# Altium project PELT_DRIVE.PrjPcb
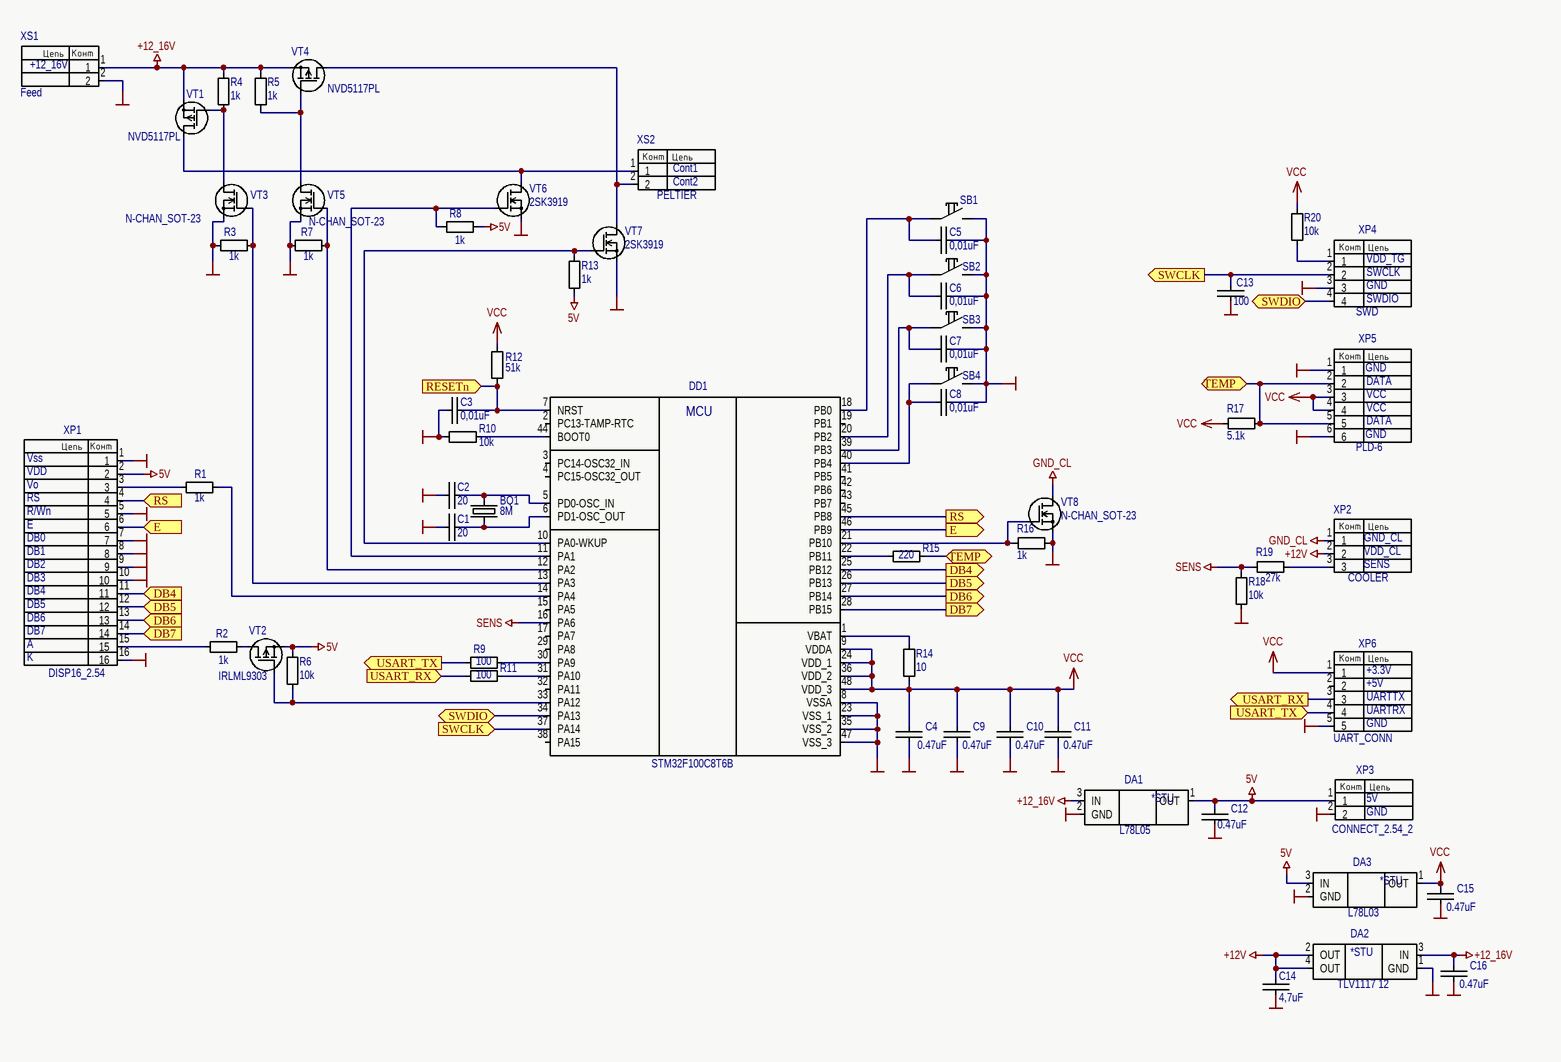
[diagram p0: PELT_DRIVE.SchDoc]
1 sheet, 61 parts. Net scope: flat (ports and power ports of the same name join across sheets).
Board file: PELT_DRIVE.PcbDoc

## Sheet PELT_DRIVE.SchDoc
size 420 x 297 mm; Scale: {Масш.}; Title1str: {Наименование}; PageSetup: Record=PageOptions|CenterHorizontal=False|CenterVertical=False|PrintScale=0.67|XCorrection=0.00|YCorrection=0.00|PrintKind=1|BorderSize=5000000|LeftOffset=0|BottomOffset=0|Orientation=2|PaperLength=1000|PaperWidth=1000|Scale=100|PaperSource=7|PrintQuality=600|MediaType=1|DitherType=10|PaperKind=A4|PrintScaleMode=1; Title2str: {Наименование}; ProcessInspection: {Т.контр.}; Mass: {Масса}; NormInspection: {Н.контр.}; EngineerName: {Инженер}; Letter1Column: {}; Letter2Column: {}; Letter3Column: {}; DocumentType: ?????????????? ?????; DocumentType1str: {Документ}; DocumentType2str: {Документ}

### Parts
BQ1  8M  [HC 49S]
C1  20  [Cap_0805]
C2  20  [Cap_0805]
C3  0,01uF  [Cap_0805]
C4  0.47uF  [Cap_0805]
C5  0,01uF  [Cap_0805]
C6  0,01uF  [Cap_0805]
C7  0,01uF  [Cap_0805]
C8  0,01uF  [Cap_0805]
C9  0.47uF  [Cap_0805]
C10  0.47uF  [Cap_0805]
C11  0.47uF  [Cap_0805]
C12  0.47uF  [Cap_0805]
C13  100  [Cap_0805]
C14  4,7uF  [Cap_0805]
C15  0.47uF  [Cap_0805]
C16  0.47uF  [Cap_0805]
DA1  L78L05  [kren]
DA2  TLV1117 12  [SOT223]
DA3  L78L03  [kren]
DD1  STM32F100C8T6B  [LQFP48]
R1  1k  [Res_0805]
R2  1k  [Res_0805]
R3  1k  [Res_0805]
R4  1k  [Res_0805]
R5  1k  [Res_0805]
R6  10k  [Res_0805]
R7  1k  [Res_0805]
R8  1k  [Res_0805]
R9  100  [Res_0805]
R10  10k  [Res_0805]
R11  100  [Res_0805]
R12  51k  [Res_0805]
R13  1k  [Res_0805]
R14  10  [Res_0805]
R15  220  [Res_0805]
R16  1k  [Res_0805]
R17  5.1k  [Res_0805]
R18  10k  [Res_0805]
R19  27k  [Res_0805]
R20  10k  [Res_0805]
SB1  BUTTON 4.5x6  [BUTTON 6x4.5]  (value not drawn)
SB2  BUTTON 4.5x6  [BUTTON 6x4.5]  (value not drawn)
SB3  BUTTON 4.5x6  [BUTTON 6x4.5]  (value not drawn)
SB4  BUTTON 4.5x6  [BUTTON 6x4.5]  (value not drawn)
VT1  NVD5117PL  [TO-252]
VT2  IRLML9303  [SOT-23]
VT3  N-CHAN_SOT-23  [SOT-23]
VT4  NVD5117PL  [TO-252]
VT5  N-CHAN_SOT-23  [SOT-23]
VT6  2SK3919  [TO-252]
VT7  2SK3919  [TO-252]
VT8  N-CHAN_SOT-23  [SOT-23]
XP1  DISP16_2.54  [DISP16_2.54]
XP2  COOLER  [CONN_2.54_3]
XP3  CONNECT_2.54_2  [CONN_2.54_2]
XP4  SWD  [CONN_2.54_4]
XP5  PLD-6  [CONN_2.54_6_2]
XP6  UART_CONN  [CONN_2.54_5]
XS1  Feed  [PELTIER]
XS2  PELTIER  [PELTIER]

### Ports
DB4 (in), DB4 (out), DB5 (in), DB5 (out), DB6 (in), DB6 (out), DB7 (in), DB7 (out), E (in), E (out), RESETn (in), RS (in), RS (out), SWCLK (in), SWCLK (out), SWDIO (bidir), TEMP (bidir), USART_RX (in), USART_RX (out), USART_TX (in), USART_TX (out)

### Nets
5V: C12.2 DA1.1(OUT) DA3.3(IN) R6.1 R8.2 R13.1 VT2.2 XP1.2 XP3.1
+12_16V: C16.2 DA1.3(IN) DA2.3(IN) R4.1 R5.2 VT1.3 VT4.3 XS1.1
+12V: C14.2 DA2.2(OUT) DA2.4(OUT) XP2.2
GND: C1.1 C2.1 C3.1 C4.1 C5.2 C6.2 C7.2 C8.2 C9.1 C10.1 C11.1 C12.1 C13.1 C14.1 C15.1 C16.1 DA1.2(GND) DA2.1(GND) DA3.2(GND) DD1.8(VSSA) DD1.23(VSS_1) DD1.35(VSS_2) DD1.47(VSS_3) R3.2 R7.1 R10.2 R16.2 R18.1 SB1.2(IN) SB2.2(IN) SB3.2(IN) SB4.2(IN) VT3.2 VT5.2 VT6.3 VT7.3 VT8.2 XP1.1 XP1.5 XP1.7 XP1.8 XP1.9 XP1.10 XP1.16 XP3.2 XP4.3 XP5.1 XP5.6 XP6.5 XS1.2
GND_CL: VT8.3 XP2.1
SENS: DD1.16(PA6) R18.2 R19.2
VCC: C4.2 C9.2 C10.2 C11.2 C15.2 DA3.1(OUT) DD1.9(VDDA) DD1.24(VDD_1) DD1.36(VDD_2) DD1.48(VDD_3) R12.2 R14.2 R17.2 R20.2 XP5.3 XP5.4 XP6.1
NetBQ1_1: BQ1.1 C1.2 DD1.6(PD1-OSC_OUT)
NetBQ1_2: BQ1.2 C2.2 DD1.5(PD0-OSC_IN)
NetC3_2: C3.2 DD1.7(NRST) R12.1 ; port RESETn
NetC5_1: C5.1 DD1.18(PB0) SB1.1(OUT)
NetC6_1: C6.1 DD1.20(PB2) SB2.1(OUT)
NetC7_1: C7.1 DD1.39(PB3) SB3.1(OUT)
NetC8_1: C8.1 DD1.40(PB4) SB4.1(OUT)
NetC13_2: C13.2 DD1.37(PA14) XP4.2 ; port SWCLK
NetDD1_1: DD1.1(VBAT) R14.1
NetDD1_10: DD1.10(PA0-WKUP) R13.2 VT7.1
NetDD1_11: DD1.11(PA1) R8.1 VT6.1
NetDD1_12: DD1.12(PA2) R7.2 VT5.1
NetDD1_13: DD1.13(PA3) R3.1 VT3.1
NetDD1_14: DD1.14(PA4) R1.1
NetDD1_21: DD1.21(PB10) R16.1 VT8.1
NetDD1_22: DD1.22(PB11) R15.2
NetDD1_25: DD1.25(PB12) XP1.11 ; port DB4
NetDD1_26: DD1.26(PB13) XP1.12 ; port DB5
NetDD1_27: DD1.27(PB14) XP1.13 ; port DB6
NetDD1_28: DD1.28(PB15) XP1.14 ; port DB7
NetDD1_30: DD1.30(PA9) R9.2
NetDD1_31: DD1.31(PA10) R11.2
NetDD1_33: DD1.33(PA12) R6.2 VT2.1
NetDD1_34: DD1.34(PA13) XP4.4 ; port SWDIO
NetDD1_44: DD1.44(BOOT0) R10.1
NetDD1_45: DD1.45(PB8) XP1.4 ; port RS
NetDD1_46: DD1.46(PB9) XP1.6 ; port E
NetR1_2: R1.2 XP1.3
NetR2_1: R2.1 VT2.3
NetR2_2: R2.2 XP1.15
NetR4_2: R4.2 VT1.1 VT3.3
NetR5_1: R5.1 VT4.1 VT5.3
NetR9_1: R9.1 XP6.4 ; port USART_TX
NetR11_1: R11.1 XP6.3 ; port USART_RX
NetR15_1: R15.1 R17.1 XP5.2 XP5.5 ; port TEMP
NetR19_1: R19.1 XP2.3
NetR20_1: R20.1 XP4.1
NetVT1_2: VT1.2 VT6.2 XS2.1
NetVT4_2: VT4.2 VT7.2 XS2.2

Not connected (* = marked no-connect by the designer): DD1 2(PC13-TAMP-RTC) 3(PC14-OSC32_IN) 4(PC15-OSC32_OUT) 15(PA5) 17(PA7) 19(PB1) 29(PA8) 32(PA11) 38(PA15) 41(PB5) 42(PB6) 43(PB7); XP6 2

### Notes on the sheet
- (near XS1) +12_16V
- (near XS2) Cont1
- (near XS2) Cont2
- (near XP4) SWDIO
- (near XP4) GND
- (near XP4) SWCLK
- (near XP4) VDD_TG
- (near XP5) GND
- (near XP5) VCC
- (near XP5) DATA
- Vss
- VDD
- Vo
- RS
- R/Wn
- E
- DB0
- DB1
- DB2
- DB3
- (near XP2) GND_CL
- (near XP2) VDD_CL
- (near XP2) SENS
- DB4
- DB5
- DB6
- DB7
- A
- K
- (near XP6) UARTRX
- (near XP6) UARTTX
- (near XP6) +5V
- (near XP6) +3.3V
- (near XP6) GND
- (near XP3) 5V
- (near XP3) GND
- (in symbol kren) *STU
- (in symbol STM32F100C8T6B) MCU
- (in symbol TLV1117) *STU

### Library data of the parts
BQ1 = BQ_HC 49S: PackageReference: HC-49S
C1 C2 = Cap_0805: Manufacturer: AVX; Part Number: 08051A200JAT2A; Replacement: GCM2165C1H200JD01J; PackageReference: 0805; Value: 20; Distributor: http://www.chipel.ru/; Price: 0.18
C3 C5-C8 = Cap_0805: Manufacturer: AVX; Part Number: 08055C103JAT2A; Replacement: GRM2195C1H103JA01D; Value: 0.01uF; PackageReference: 0805; Distributor: http://www.chipel.ru/; Price: 0.30
C4 C9-C12 C15 C16 = Cap_0805: Manufacturer: AVX; Part Number: 0805YC475KAT2A; Replacement: GRM21BR61E475KA12L; Value: 1uF; PackageReference: 0805; Distributor: http://www.kontest.ru; Price: 9.53
C13 = Cap_0805: Manufacturer: AVX; Part Number: 08055C101KAT2A; Replacement: GRM2165C2A101JA01D; ASSY_OPT: ASSY_OPT; PackageReference: PackageReference; Value: 100; Distributor: http://www.chipel.ru/; Price: 8.00
C14 = Cap_0805: 4.7uF 25V X7R 10%; Manufacturer: AVX; Part Number: 0805YC475KAT2A; Replacement: 4.7uF 25V X5R 10% 0805; PackageReference: 0805; Value: 4.7uF; Distributor: http://www.kontest.ru; Price: 9.53
DA1 = kren: Part Number: L78L05
DA2 = TLV1117: TLV1117-sot223; Manufacturer: Microchip; PackageReference: SOT-223; Part Number: TLV1117; Distributor: http://radel.ru; Price: 20
DA3 = kren: Part Number: L78L05
R1 R2 R15 = Res_0805: Value: 100; PackageReference: 0805
R3 R5 R7 R9 R11 R16 = Res_0805
  R3 R7 R16: Value: 1k
  R5: PackageReference: 0805 1k
  R9 R11: PackageReference: 0805; Value: 100
R4 = Res_0805: Manufacturer: Vishay; Replacement: RC0805JR 0710KL; Value: 10k; PackageReference: 0805; Part Number: SMD 0805; Distributor: http://www.kontest.ru; Price: 0.30
R6 R10 = Res_0805: Manufacturer: Vishay; Part Number: CRCW080510K0JNTA; Replacement: RC0805JR 0710KL; PackageReference: 0805; Value: 10k; Distributor: http://www.kontest.ru; Price: 0.30
R8 R13 = Res_0805: Part Number: 0805 1k
R12 = Res_0805: Manufacturer: Vishay; Part Number: CRCW08055K00JNTA; Replacement: RC0805JR-0751KL; PackageReference: 0805; Value: 51k; Distributor: http://www.abtronics.ru; Price: 1.50
R14 = Res_0805: Manufacturer: Vishay; Part Number: CRCW080510R0FKEA; Replacement: RC0805JR-0710RL; PackageReference: 0805; Value: 10; Distributor: http://www.platan.ru; Price: 0.24
R17 = Res_0805: Manufacturer: Vishay; Part Number: CRCW08055K10JNTA; Replacement: 0.30; PackageReference: 0805; Value: 5.1k; Distributor: http://www.kontest.ru; Price: Price
R18 R20 = Res_0805: Manufacturer: Vishay; Part Number: CRCW080510K0JNTA; Replacement: 0.30; PackageReference: 0805; Value: 10k; Distributor: http://www.kontest.ru; Price: Price
R19 = Res_0805: Manufacturer: Vishay; Part Number: CRCW080527K0JNTA; Replacement: 0.30; PackageReference: 0805; Value: 27k; Distributor: http://www.kontest.ru; Price: Price
SB1-SB4 = BUTTON 4.5x6: Button
VT1 VT4 = P-CHAN_TO-252: Part Number: NVD5117PL
VT2 = P-CHAN_SOT-23: Part Number: IRLML9303TRPBF; Distributor: http://platan.ru/
VT6 VT7 = N-CHAN_TO-252: Part Number: 2SK3919
XP2 = CONNECT_2.54_3
XP4 = CONNECT_SWD: ASSY_OPT: ASSY_OPT; Manufacturer: Manufacturer; PackageReference: PackageReference; Replacement: Replacement; Part Number: Part Number; Value: Value; Distributor: Distributor; Price: Price
XP5 = CONNECT_2.54_6_2
XP6 = CONNECT_2.54_5
XS1 = PELTIER
DD1 = STM32F100C8T6B: ASSY_OPT: ASSY_OPT; Manufacturer: Manufacturer; PackageReference: PackageReference; Replacement: Replacement; Part Number: Part Number; Value: Value; Distributor: Distributor; Price: Price